# EAGLE design practice 1 (EAGLE 9.6.2)
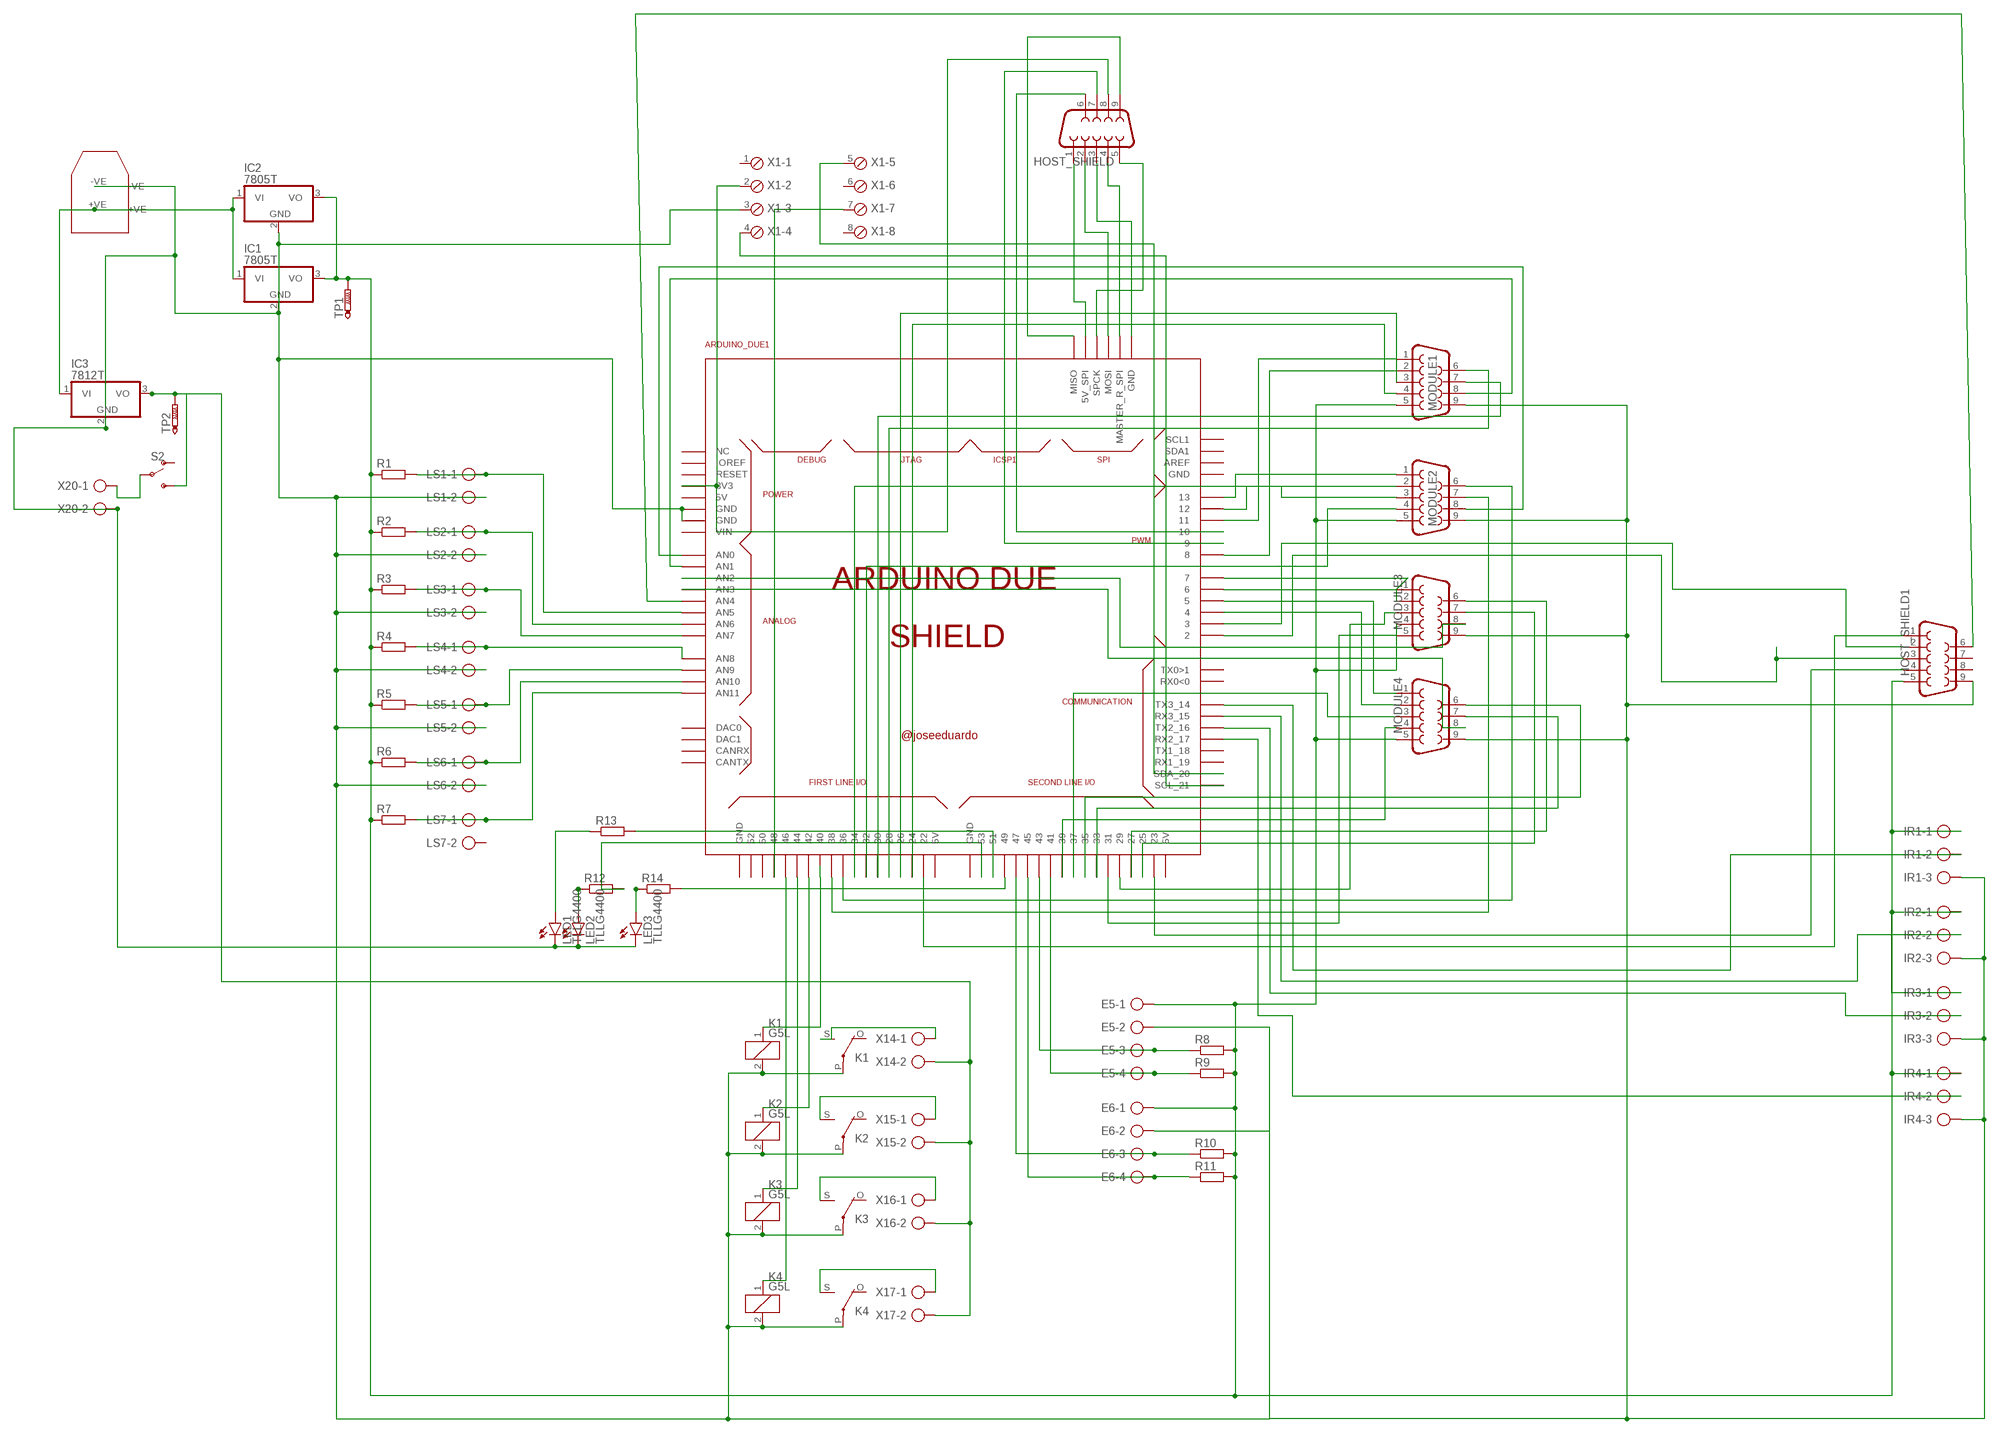
[diagram p0: schematic, sheet 1]

## Parts
ARDUINO_DUE1  ARDUINO_DUE_SHIELD  [ARDUINO_DUE_SHIELD]
E5  AK500/4-H  [AK500/4-H]
E6  AK500/4-H  [AK500/4-H]
HOST_SHIELD  DB9  [DB9_MODULE]
HOST_SHIELD1  DB9  [DB9_MODULE]
IC1  7805T  [TO220H]
IC2  7805T  [TO220H]
IC3  7812T  [TO220H]
IR1  AK500/3-H  [AK500/3-H]
IR2  AK500/3-H  [AK500/3-H]
IR3  AK500/3-H  [AK500/3-H]
IR4  AK500/3-H  [AK500/3-H]
K1  G5L  [G5LE]
K2  G5L  [G5LE]
K3  G5L  [G5LE]
K4  G5L  [G5LE]
LED1  TLLG4400  [LED3MM]
LED2  TLLG4400  [LED3MM]
LED3  TLLG4400  [LED3MM]
LS1  AK500/2-H  [AK500/2-H]
LS2  AK500/2-H  [AK500/2-H]
LS3  AK500/2-H  [AK500/2-H]
LS4  AK500/2-H  [AK500/2-H]
LS5  AK500/2-H  [AK500/2-H]
LS6  AK500/2-H  [AK500/2-H]
LS7  AK500/2-H  [AK500/2-H]
MODULE1  DB9  [DB9_MODULE]
MODULE2  DB9  [DB9_MODULE]
MODULE3  DB9  [DB9_MODULE]
MODULE4  DB9  [DB9_MODULE]
R1  R-EU_0309/10  [0309/10]
R2  R-EU_0309/10  [0309/10]
R3  R-EU_0309/10  [0309/10]
R4  R-EU_0309/10  [0309/10]
R5  R-EU_0309/10  [0309/10]
R6  R-EU_0309/10  [0309/10]
R7  R-EU_0309/10  [0309/10]
R8  R-EU_0309/10  [0309/10]
R9  R-EU_0309/10  [0309/10]
R10  R-EU_0309/10  [0309/10]
R11  R-EU_0309/10  [0309/10]
R12  R-EU_0309/10  [0309/10]
R13  R-EU_0309/10  [0309/10]
R14  R-EU_0309/10  [0309/10]
S2  SWITCH-SPDT-PTH-11.6X4.0MM  [SWITCH_SPDT_PTH_11.6X4.0MM]
TP1  PTR1PAD1-13  [P1-13]
TP2  PTR1PAD1-13  [P1-13]
U$1  XT60XT60  [XT60]
X1  MPT8  [8POL254]
X14  AK500/2-H  [AK500/2-H]
X15  AK500/2-H  [AK500/2-H]
X16  AK500/2-H  [AK500/2-H]
X17  AK500/2-H  [AK500/2-H]
X20  AK500/2-H  [AK500/2-H]

## Nets
GND: ARDUINO_DUE1.GND ARDUINO_DUE1.GND_1(GND) E5.2 E6.2 HOST_SHIELD1.9 IC1.2(GND) IC2.2(GND) IC3.2(GND) IR1.3 IR2.3 IR3.3 IR4.3 K1.2 K1.P(2:P) K2.2 K2.P(2:P) K3.2 K3.P(2:P) K4.2 K4.P(2:P) LED1.K(C) LED2.K(C) LED3.K(C) LS1.2 LS2.2 LS3.2 LS4.2 LS5.2 LS6.2 MODULE1.9 MODULE2.9 MODULE3.9 MODULE4.9 U$1.-VE X1.3 X20.2
N$1: ARDUINO_DUE1.35 MODULE4.6
N$2: ARDUINO_DUE1.37 MODULE4.3
N$3: ARDUINO_DUE1.39 MODULE4.4
N$4: ARDUINO_DUE1.A5(AN5) LS1.1 R1.2
N$5: ARDUINO_DUE1.A6(AN6) LS2.1 R2.2
N$6: ARDUINO_DUE1.A7(AN7) LS3.1 R3.2
N$7: ARDUINO_DUE1.A8(AN8) LS4.1 R4.2
N$8: ARDUINO_DUE1.A9(AN9) LS5.1 R5.2
N$9: ARDUINO_DUE1.A10(AN10) LS6.1 R6.2
N$10: ARDUINO_DUE1.A11(AN11) LS7.1 R7.2
N$11: ARDUINO_DUE1.3 HOST_SHIELD1.2
N$12: ARDUINO_DUE1.43 E5.3 R8.1
N$13: ARDUINO_DUE1.A4(AN4) HOST_SHIELD1.6
N$14: ARDUINO_DUE1.40 K1.1
N$15: ARDUINO_DUE1.41 E5.4 R9.1
N$16: ARDUINO_DUE1.47 E6.3 R10.1
N$17: ARDUINO_DUE1.45 E6.4 R11.1
N$18: ARDUINO_DUE1.53 R12.2
N$19: IC1.1(VI) IC2.1(VI) IC3.1(VI) U$1.+VE
N$20: ARDUINO_DUE1.42 K2.1
N$21: ARDUINO_DUE1.44 K3.1
N$22: ARDUINO_DUE1.46 K4.1
N$23: ARDUINO_DUE1.2 HOST_SHIELD1.3
N$24: ARDUINO_DUE1.22 HOST_SHIELD1.1
N$25: ARDUINO_DUE1.23 HOST_SHIELD1.4
N$26: IC3.3(VO) S2.3(S) TP2.TP X14.2 X15.2 X16.2 X17.2
N$27: K1.S(2:S) X14.1
N$28: K2.S(2:S) X15.1
N$29: K3.S(2:S) X16.1
N$30: K4.S(2:S) X17.1
N$31: S2.2(P) X20.1
N$32: ARDUINO_DUE1.14(TX3_14) IR1.2
N$33: ARDUINO_DUE1.15(RX3_15) IR2.2
N$34: ARDUINO_DUE1.16(TX2_16) IR3.2
N$35: ARDUINO_DUE1.17(RX2_17) IR4.2
N$37: ARDUINO_DUE1.3V3 HOST_SHIELD.8 X1.2
N$38: ARDUINO_DUE1.21(SCL_21) X1.4
N$39: ARDUINO_DUE1.20(SDA_20) X1.5
N$40: ARDUINO_DUE1.48 X1.7
N$41: ARDUINO_DUE1.5V_2(5V_SPI) HOST_SHIELD.1
N$42: ARDUINO_DUE1.MOSI HOST_SHIELD.2
N$43: ARDUINO_DUE1.GND_5(GND) HOST_SHIELD.3
N$44: ARDUINO_DUE1.11 MODULE1.1
N$45: ARDUINO_DUE1.8 MODULE1.2
N$46: ARDUINO_DUE1.26 MODULE1.3
N$47: ARDUINO_DUE1.24 MODULE1.4
N$48: ARDUINO_DUE1.28 MODULE1.6
N$49: ARDUINO_DUE1.30 MODULE1.7
N$50: ARDUINO_DUE1.13 MODULE2.1
N$51: ARDUINO_DUE1.12 MODULE2.2
N$52: ARDUINO_DUE1.34 MODULE2.3
N$53: ARDUINO_DUE1.36 MODULE2.6
N$54: ARDUINO_DUE1.32 MODULE2.4
N$55: ARDUINO_DUE1.38 MODULE2.7
N$56: ARDUINO_DUE1.A1(AN1) MODULE1.8
N$57: ARDUINO_DUE1.A0(AN0) MODULE2.8
N$58: ARDUINO_DUE1.A2(AN2) MODULE3.8
N$59: ARDUINO_DUE1.A3(AN3) MODULE4.8
N$60: ARDUINO_DUE1.7 MODULE3.1
N$61: ARDUINO_DUE1.6 MODULE3.2
N$62: ARDUINO_DUE1.5 MODULE4.1
N$63: ARDUINO_DUE1.4 MODULE4.2
N$64: ARDUINO_DUE1.29 MODULE3.3
N$65: ARDUINO_DUE1.31 E5.1 E6.1 HOST_SHIELD1.5 IC1.3(VO) IC2.3(VO) IR1.1 IR2.1 IR3.1 IR4.1 MODULE1.5 MODULE2.5 MODULE3.4 MODULE3.5 MODULE4.5 R1.1 R2.1 R3.1 R4.1 R5.1 R6.1 R7.1 R8.2 R9.2 R10.2 R11.2 TP1.TP
N$66: ARDUINO_DUE1.25 MODULE3.7
N$67: ARDUINO_DUE1.27 MODULE3.6
N$68: ARDUINO_DUE1.33 MODULE4.7
N$69: ARDUINO_DUE1.MISO HOST_SHIELD.9
N$70: ARDUINO_DUE1.MASTER_RESET_SPI(MASTER_R_SPI) HOST_SHIELD.4
N$71: ARDUINO_DUE1.SPCK HOST_SHIELD.5
N$72: ARDUINO_DUE1.49 R14.2
N$73: ARDUINO_DUE1.51 R13.2
N$74: LED2.A R12.1
N$75: ARDUINO_DUE1.9 HOST_SHIELD.7
N$76: ARDUINO_DUE1.10 HOST_SHIELD.6
N$77: LED1.A R13.1
N$78: LED3.A R14.1
Unconnected: ARDUINO_DUE1.0(RX0<0) ARDUINO_DUE1.1(TX0>1) ARDUINO_DUE1.5V0(5V) ARDUINO_DUE1.5V0_1(5V) ARDUINO_DUE1.5V0_2(5V) ARDUINO_DUE1.18(TX1_18) ARDUINO_DUE1.19(RX1_19) ARDUINO_DUE1.50 ARDUINO_DUE1.52 ARDUINO_DUE1.AREF ARDUINO_DUE1.CANRX ARDUINO_DUE1.CANTX ARDUINO_DUE1.DAC0 ARDUINO_DUE1.DAC1 ARDUINO_DUE1.GND_2(GND) ARDUINO_DUE1.GND_3(GND) ARDUINO_DUE1.GND_4(GND) ARDUINO_DUE1.IOREF ARDUINO_DUE1.NC_2(NC) ARDUINO_DUE1.RESET ARDUINO_DUE1.SCL1 ARDUINO_DUE1.SDA1 ARDUINO_DUE1.VIN HOST_SHIELD1.7 HOST_SHIELD1.8 K1.O(2:O) K2.O(2:O) K3.O(2:O) K4.O(2:O) LS7.2 S2.1(O) X1.1 X1.6 X1.8

## Library data of the parts
ARDUINO_DUE1 = arduino_due_shield (1):ARDUINO_DUE_SHIELD
E5 E6 = con-ptr500:AK500/4-H: CONNECTOR Aug. 2004 / PTR Meßtechnik: Die Bezeichnung der Serie AK505 wurde geändert. Es handelt sich hierbei um AK500 in horizontaler Ausführung.; OC_FARNELL: unknown; OC_NEWARK: unknown
HOST_SHIELD HOST_SHIELD1 MODULE1-MODULE4 = db9_main:DB9
IC1-IC3 = linear:78*: Positive VOLTAGE REGULATOR Source: http://cache.national.com/ds/LM/LM78L05.pdf http://www.fairchildsemi.com/ds/LM/LM7805.pdf
IR1-IR4 = con-ptr500:AK500/3-H: CONNECTOR Aug. 2004 / PTR Meßtechnik: Die Bezeichnung der Serie AK505 wurde geändert. Es handelt sich hierbei um AK500 in horizontaler Ausführung.; OC_FARNELL: unknown; OC_NEWARK: unknown
K1-K4 = relay:G5L: RELAY 1 x switch, 10 A/120 V AC, 8 A/30 V ADC, Omron; OC_FARNELL: unknown; OC_NEWARK: unknown
LED1-LED3 = led:TLLG4400: Low Current (2mA) LED 3 mm Tinted Diffused Package color GREEN Source: Data sheet <http://www.farnell.com/datasheets/391098.pdf>; MF: VISHAY SEMICONDUCTOR; OC_FARNELL: 1612435
LS1-LS7 X14-X17 X20 = con-ptr500:AK500/2-H: CONNECTOR Aug. 2004 / PTR Meßtechnik: Die Bezeichnung der Serie AK505 wurde geändert. Es handelt sich hierbei um AK500 in horizontaler Ausführung.; OC_FARNELL: unknown; OC_NEWARK: unknown
R1-R14 = rcl:R-EU_: RESISTOR, European symbol; SPICEPREFIX: R
S2 = SparkFun-Switches:SWITCH-SPDT: Single Pole, Double Throw (SPDT) Switch Single-pole, double-throw (SPDT) switch. Variant Overview SMD-AYZ0202 Surface Mount DPDT Switch <https://www.sparkfun.com/products/597> (COM-00597) Used on e.g. LilyPad Arduino USB - ATmega32U4 Board <https://www.sparkfun.com/products/12049> PTH-11.6X4.0MM SPDT Mini Power Switch <https://www.sparkfun.com/products/102> (COM-00102) Used on e.g. SparkFun Simon Says - Through-Hole Soldering Kit <https://www.sparkfun.com/products/10547> (KIT-10547) PTH-11.6X4.0MM-KIT KIT version of SPDT Mini Power Switch - Simplifies soldering by removing tStop of switch pins - only one side can be soldered. PTH-11.6X4.0MM-LOCK LOCK version of SPDT Mini Power Switch - Offset pins hold switch in place for easier soldering. SMD-RIGHT-ANGLE Surface Mount Right Angle Switch <https://www.sparkfun.com/products/10860> (COM-10860) Used on e.g. SparkFun ESP8266 Thing <https://www.sparkfun.com/products/13231>; PROD_ID: SWCH-08261; SF_SKU: COM-00102
TP1 TP2 = testpad:PTR1: TEST PIN
U$1 = xt60:XT60: XT60 connector
X1 = con-phoenix-254:MPT8: PHOENIX CONNECTOR; OC_FARNELL: unknown; OC_NEWARK: unknown

## Board
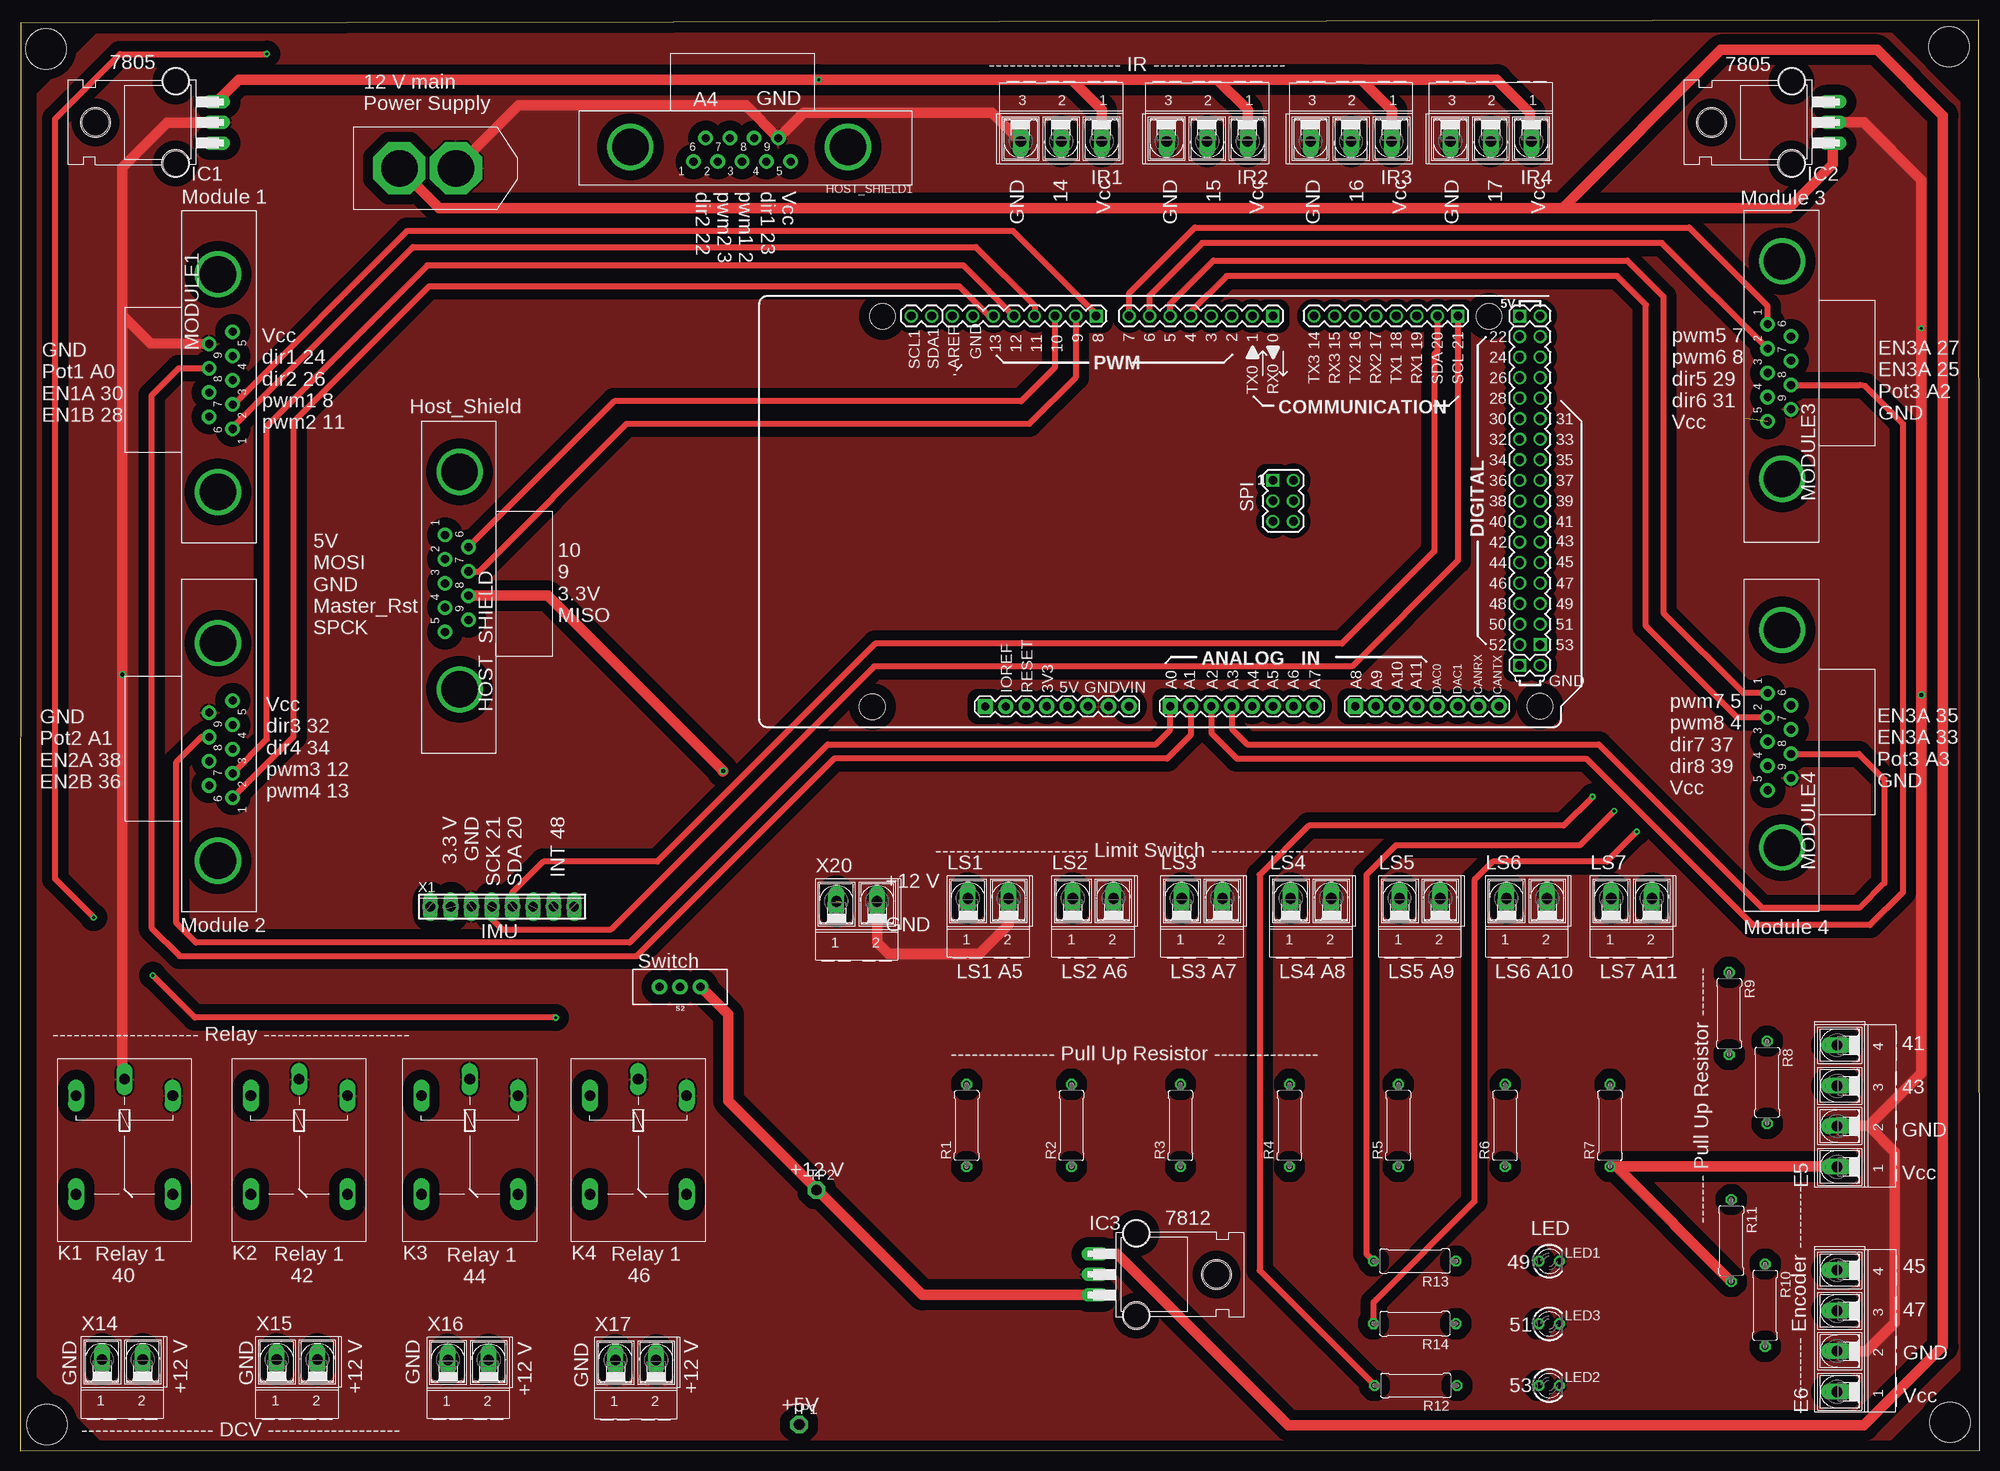
[diagram p1: board, top side]
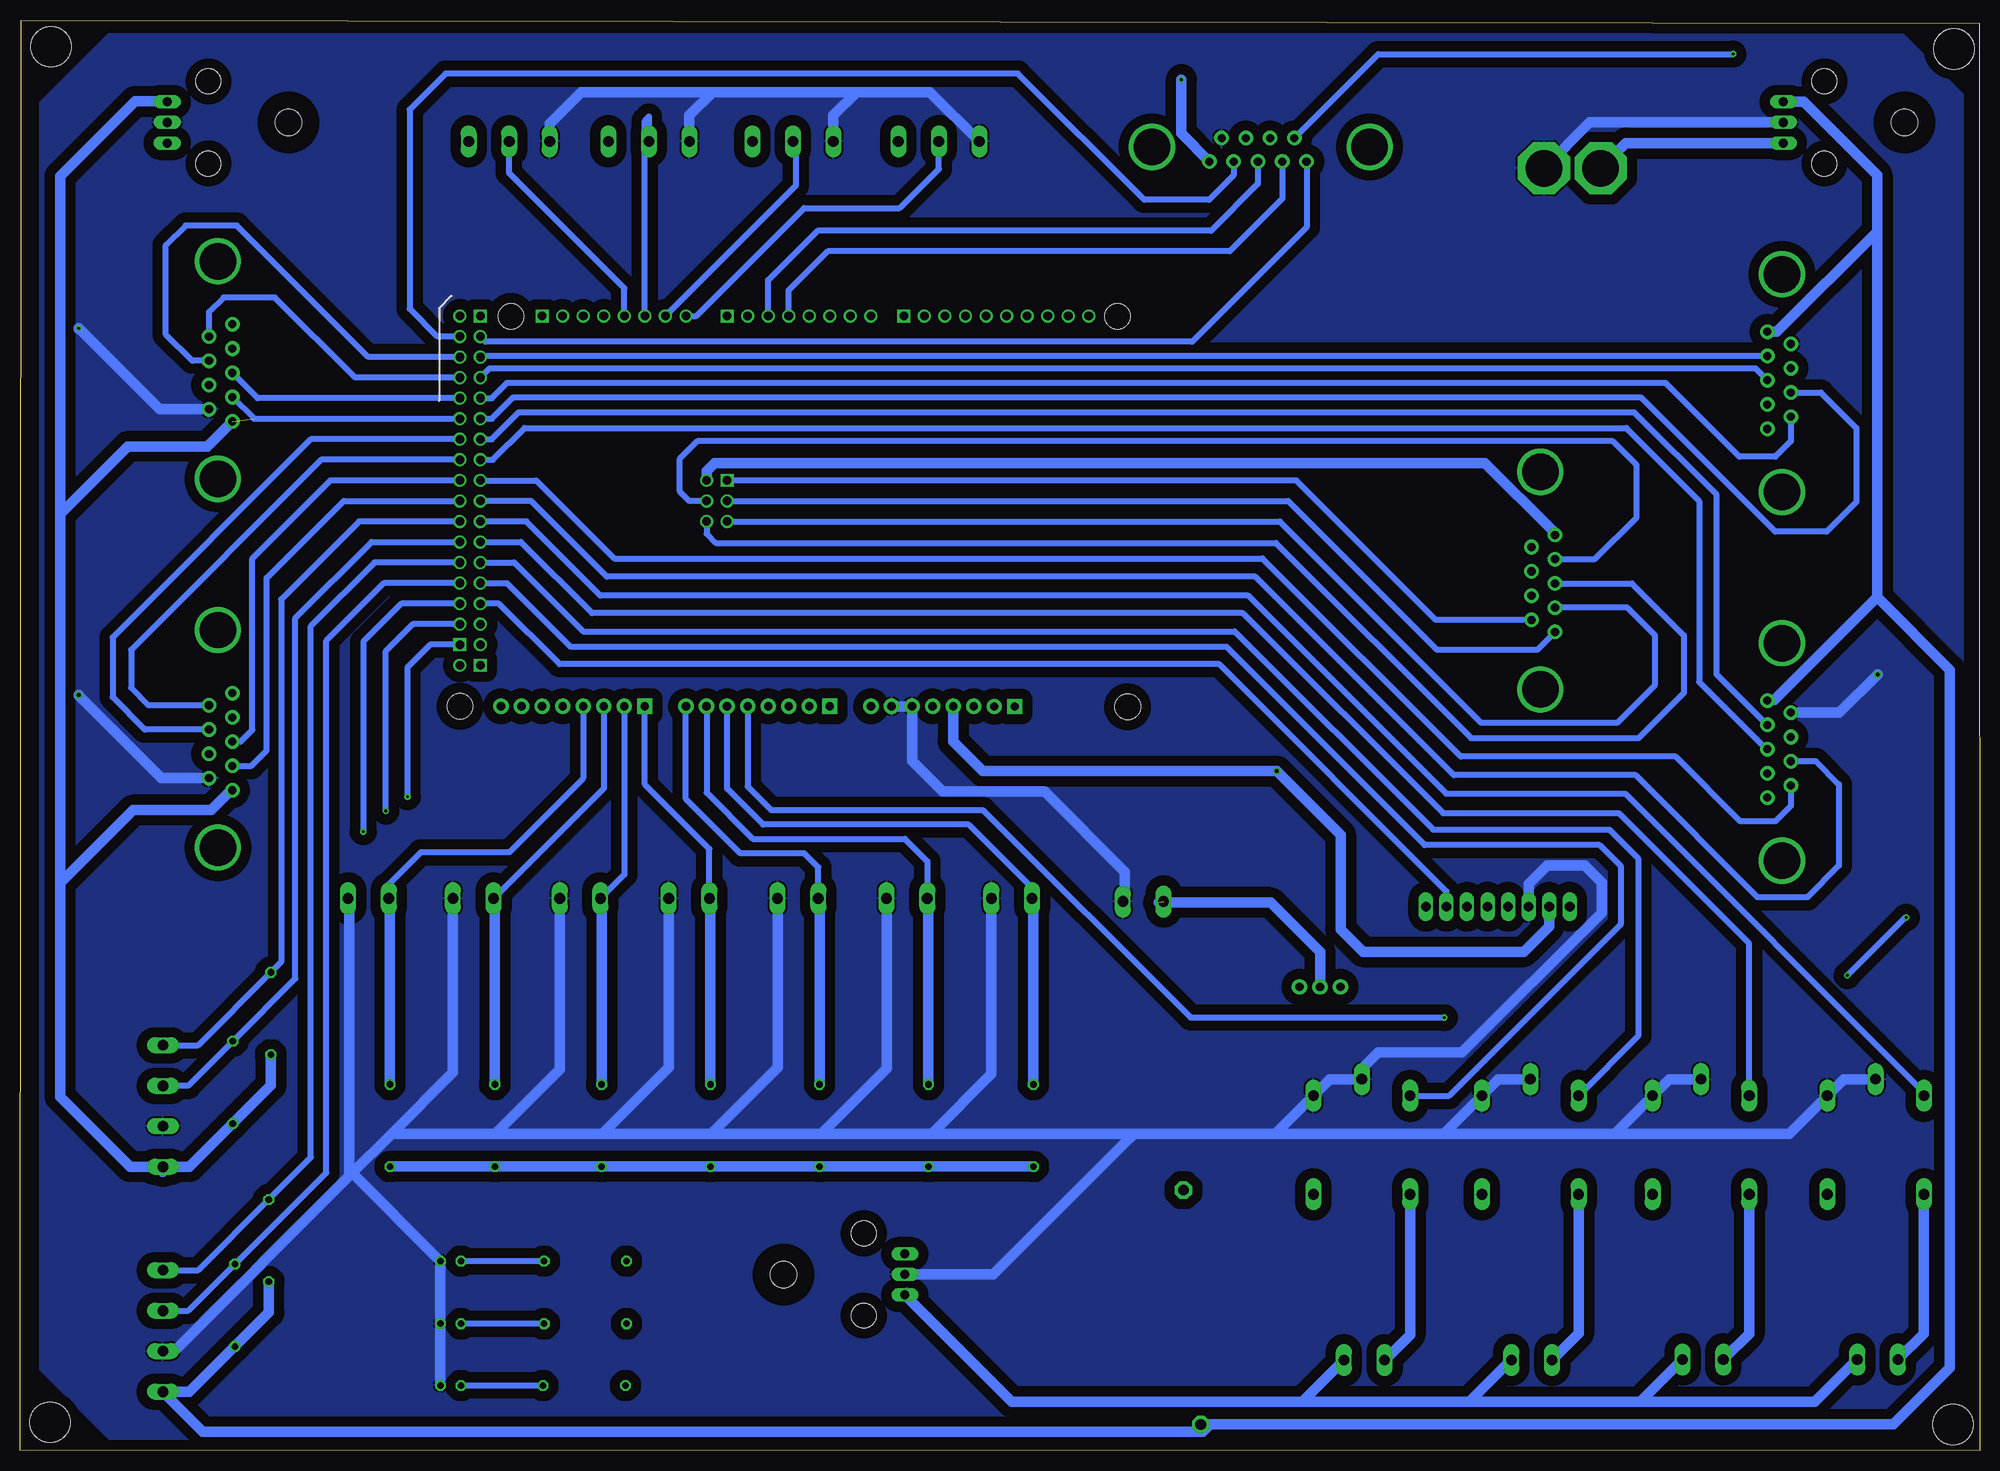
[diagram p2: board, bottom side, seen from below]

Size 242.17 x 176.85 mm. Coordinates in mm from the lower left corner, seen from the top.
Outline: 0,0 242.17,0.05 242.01,176.85 0.05,176.49 0,0
Copper layers (1*16): Top 0.035mm / dielectric 1.5mm / Bottom 0.035mm
Design rules "default": minimum track width 6mil, minimum drill 0.35mm, track to track 6mil, track to pad 6mil, pad to pad 6mil, via to via 6mil, smd to smd 6mil, copper to edge 40mil, drill to drill 6mil, minimum pad ring 10mil, minimum via ring 8mil, stop-mask expansion 4mil, vias tented up to drill 0mil, thermal gap 10mil
Holes 5 mm at 3.17,173.3 3.3,3.25 238.51,3.51 238.38,173.56

### Footprints (pad centres in the part's own frame; a part is rotated, then mirrored left to right if it is on the bottom)
ARDUINO_DUE_SHIELD = drill 1.067 square: 0 63.373,51.816; 5V0_1 93.853,51.816; 8 41.529,51.816; 21 86.233,51.816; 53 96.393,11.176; GND_2 93.853,8.636; MISO 63.373,31.496 | drill 1.067: 1 60.833,51.816; 2 58.293,51.816; 3 55.753,51.816; 4 53.213,51.816; 5 50.673,51.816; 5V0_2 96.393,51.816; 5V_2 65.913,31.496; 6 48.133,51.816; 7 45.593,51.816; 9 38.989,51.816; 10 36.449,51.816; 11 33.909,51.816; 12 31.369,51.816; 13 28.829,51.816; 14 68.453,51.816; 15 70.993,51.816; 16 73.533,51.816; 17 76.073,51.816; 18 78.613,51.816; 19 81.153,51.816; 20 83.693,51.816; 22 93.853,49.276; 23 96.393,49.276; 24 93.853,46.736; 25 96.393,46.736; 26 93.853,44.196; 27 96.393,44.196; 28 93.853,41.656; 29 96.393,41.656; 30 93.853,39.116; 31 96.393,39.116; 32 93.853,36.576; 33 96.393,36.576; 34 93.853,34.036; 35 96.393,34.036; 36 93.853,31.496; 37 96.393,31.496; 38 93.853,28.956; 39 96.393,28.956; 40 93.853,26.416; 41 96.393,26.416; 42 93.853,23.876; 43 96.393,23.876; 44 93.853,21.336; 45 96.393,21.336; 46 93.853,18.796; 47 96.393,18.796; 48 93.853,16.256; 49 96.393,16.256; 50 93.853,13.716; 51 96.393,13.716; 52 93.853,11.176; AREF 23.749,51.816; GND_3 96.393,8.636; GND_4 26.289,51.816; GND_5 65.913,26.416; MASTER_RESET_SPI 63.373,26.416; MOSI 65.913,28.956; SCL1 18.669,51.816; SDA1 21.209,51.816; SPCK 63.373,28.956 | drill 1.016 pad 1.88: 3V3 35.433,3.556; 5V0 37.973,3.556; A1 53.213,3.556; A2 55.753,3.556; A3 58.293,3.556; A4 60.833,3.556; A5 63.373,3.556; A6 65.913,3.556; A7 68.453,3.556; A9 76.073,3.556; A10 78.613,3.556; A11 81.153,3.556; CANRX 88.773,3.556; CANTX 91.313,3.556; DAC0 83.693,3.556; DAC1 86.233,3.556; GND 40.513,3.556; GND_1 43.053,3.556; IOREF 30.346,3.543; RESET 32.893,3.555; VIN 45.593,3.556 | drill 1.016 pad 1.88 square: A0 50.673,3.556; A8 73.533,3.556; NC_2 27.806,3.543 | hole 3.2: 96.393,3.556; 15.138,51.765; 90.068,51.765; 13.868,3.505
AK500/4-H = drill 1.321 long: 1 -7.518,0; 2 -2.489,0; 3 2.489,0; 4 7.518,0
DB9_MODULE = drill 1 pad 1.8: 1 6.46,12.91; 2 3.46,12.91; 3 0.46,12.91; 4 -2.54,12.91; 5 -5.54,12.91; 6 4.96,10.01; 7 1.96,10.01; 8 -1.04,10.01; 9 -4.04,10.01 | drill 4.5 pad 5.7: 10 -12.64,11.11; 11 14.26,11.11
TO220H = drill 1.118 long: 1 -2.54,-10.16; 2 0,-10.16; 3 2.54,-10.16 | hole 3.302: 0,4.826 | hole 3.1: -5.08,-5.08; 5.08,-5.08
AK500/3-H = drill 1.321 long: 1 -5.004,0; 2 0,0; 3 5.004,0
G5LE = drill 1.321 long: 1 -7.493,-5.969; 2 -7.493,5.969; O 4.699,5.969; P -9.525,0; S 4.699,-5.969
LED3MM = drill 0.813 octagon: A -1.27,0; K 1.27,0
AK500/2-H = drill 1.321 long: 1 -2.515,0; 2 2.515,0
0309/10 = drill 0.813 octagon: 1 -5.08,0; 2 5.08,0
SWITCH_SPDT_PTH_11.6X4.0MM = drill 1.016 pad 1.88: 1 0,2.54; 2 0,0; 3 0,-2.54
P1-13 = drill 1.321 pad 2.159 octagon: TP 0,0
XT60 = drill 4.5 pad 6.452 octagon: +VE 0,-7; -VE 0,0
8POL254 = drill 1.2 long: 1 -8.89,0; 2 -6.35,0; 3 -3.81,0; 4 -1.27,0; 5 1.27,0; 6 3.81,0; 7 6.35,0; 8 8.89,0

### Placement (x,y rotation side)
ARDUINO_DUE1  91.44,88.47 0 top
E5  224.54,42.62 90 top
E6  224.54,14.81 90 top
HOST_SHIELD  65.41,106.76 90 top
HOST_SHIELD1  89.66,172.29 180 top
IC1  14.12,164.21 90 top
IC2  213.84,164.21 90 top
IC3  143,21.79 270 top
IR1  128.65,161.87 180 top
IR2  146.69,161.87 180 top
IR3  164.47,161.87 180 top
IR4  181.74,161.87 180 top
K1  12.88,36.4 270 top
K2  34.47,36.4 270 top
K3  55.55,36.4 270 top
K4  76.38,36.4 270 top
LED1  188.98,23.44 0 top
LED2  188.98,8.08 0 top
LED3  188.98,15.7 0 top
LS1  119.63,68.28 0 top
LS2  132.59,68.28 0 top
LS3  146.05,68.28 0 top
LS4  159.51,68.28 0 top
LS5  172.97,68.28 0 top
LS6  186.18,68.28 0 top
LS7  199.14,68.28 0 top
MODULE1  13.34,132.79 270 top
MODULE2  13.34,87.2 270 top
MODULE3  228.85,132.79 90 top
MODULE4  228.85,87.2 90 top
R1  116.97,40.21 90 top
R2  129.92,40.21 90 top
R3  143.38,40.21 90 top
R4  156.84,40.21 90 top
R5  170.31,40.21 90 top
R6  183.52,40.21 90 top
R7  196.47,40.21 90 top
R8  215.9,45.54 270 top
R9  211.2,54.05 270 top
R10  215.65,17.98 270 top
R11  211.46,25.98 270 top
R12  172.47,8.08 180 top
R13  172.34,23.44 180 top
R14  172.34,15.7 180 top
S2  81.53,57.35 90 top
TP1  96.27,3.25 0 top
TP2  98.43,32.21 0 top
U$1  53.85,158.55 270 top
X1  59.56,67.26 0 top
X14  12.62,11.28 0 top
X15  34.21,11.28 0 top
X16  55.37,11.23 0 top
X17  76.07,11.2 0 top
X20  103.38,67.89 0 top

### Tracks (layer width: path | path; a pad name or v marks a point on that pad's centre or on a via)
GND  (via drill 0.35, 0.5)
  Top 1.27: IC1.2 24.26,164.19 18.19,164.19 12.62,158.62 12.62,140.41 | 13,46.05 K1.P 12.62,46.18 v12.62,95.96 12.62,140.41 | 12.62,140.41 16.08,136.95 MODULE1.9 | E5.2 228.42,40.13 | 228.42,40.13 231.65,36.91 231.65,15.82 228.14,12.32 E6.2 | IC2.2 227.81,164.21 234.95,157.07 v234.95,138.76 v234.95,93.42 234.95,46.66 228.42,40.13 | LS1.2 122.15,65.08 118.49,61.42 107.34,61.42 105.89,62.87 X20.2 | U$1.-VE 61.62,166.32 89.66,166.32 HOST_SHIELD1.9 96.85,165.43 120.09,165.43 IR1.3
  Bottom 1.27: LS1.2 122.15,46.58 129.54,39.19 | 129.54,39.19 143.18,39.19 | LS2.2 135.1,47.27 143.18,39.19 | LS3.2 148.56,47.4 156.46,39.5 156.46,39.19 | LS4.2 162.03,47.4 170.18,39.24 170.18,39.19 | LS5.2 175.49,47.14 183.44,39.19 | LS6.2 188.7,46.76 196.27,39.19 | 45.14,39.19 23.55,39.19 K1.2 16.82,45.92 K1.P | 87.02,39.22 K4.2 80.31,45.92 K4.P 76.38,47.19 74.35,49.23 64.01,49.23 46.74,66.5 46.74,70.26 48.82,72.34 53.47,72.34 55.75,70.05 X1.3 | 87.02,39.22 87.05,39.19 104.52,39.19 | 66.22,39.19 45.14,39.19 | 45.14,39.19 K2.2 38.41,45.92 K2.P | 66.22,39.19 K3.2 59.49,45.92 K3.P | IR1.3 129.74,167.97 138.81,167.97 | 138.81,167.97 156.59,167.97 | 156.59,167.97 172.85,167.97 176.73,164.08 IR4.3 | IR3.3 159.46,165.1 156.59,167.97 | IR2.3 141.68,165.1 138.81,167.97 | 104.52,39.19 129.54,39.19 | 105.92,37.8 | 105.92,37.8 121.92,21.79 IC3.2 | 105.92,37.8 104.52,39.19 | 66.22,39.19 87,39.19 87.02,39.22 | 143.18,39.19 156.46,39.19 | 156.46,39.19 170.18,39.19 | 170.18,39.19 183.44,39.19 | 183.44,39.19 196.27,39.19 | 196.27,39.19 201.38,34.07 | 201.38,34.07 223.14,12.32 E6.2 | v234.95,93.42 234.95,93.35 224.76,83.16 MODULE4.9 | IC1.2 48.18,164.21 U$1.-VE | 234.95,138.68 v234.95,138.76 224.94,128.75 MODULE3.9 | LED2.K LED3.K LED1.K 201.52,34.72 | 201.52,68.15 201.52,34.72 | 201.52,34.72 201.52,34.21 201.38,34.07 | MODULE2.9 17.35,91.24 v12.62,95.96 | ARDUINO_DUE1.GND_1 ARDUINO_DUE1.GND 131.95,85.29 128.14,81.48 115.57,81.48 105.66,71.58 105.66,68.12 X20.2
  pour Top (isolate 1.27): 2.03,166.57 2.03,9.22 9.91,1.35 231.14,1.35 239.78,9.98 239.78,166.7 231.27,175.21 9.53,175.21 2.16,167.84 2.03,167.72
  pour Bottom (isolate 1.27): 2.03,166.57 2.03,9.22 9.78,1.47 9.91,1.35 11.3,1.35 231.14,1.35 239.65,9.86 239.78,9.98 239.78,166.7 231.39,175.08 231.27,175.21 227.84,175.21 9.53,175.21 2.03,167.72
N$1
  Bottom 0.762: ARDUINO_DUE1.35 204.98,122.5 228.47,99.01 228.47,94.31 226.32,92.16 MODULE4.6
N$2
  Bottom 0.762: ARDUINO_DUE1.37 203.84,119.96 213.49,110.31 213.49,89.1 214.93,87.66 MODULE4.3
N$3
  Bottom 0.762: ARDUINO_DUE1.39 202.18,117.42 211.71,107.9 211.71,86.56 213.61,84.66 MODULE4.4 215.17,84.66
N$4
  Bottom 0.762: LS1.1 117.12,69.57 124.97,77.42 150.37,77.42 154.81,81.86 ARDUINO_DUE1.A5
  Bottom 1.27: LS1.1 116.99,68.15 116.99,45.31 R1.2
N$5
  Bottom 0.762: ARDUINO_DUE1.A6 157.35,81.36 151.64,75.64 132.84,75.64 130.07,72.87 LS2.1
  Bottom 1.27: LS2.1 129.95,68.15 129.95,45.31 R2.2
N$6
  Bottom 0.762: 143.76,68.28 LS3.1 143.53,72.11 145.29,73.86 153.16,73.86 159.89,80.59 ARDUINO_DUE1.A7
  Bottom 1.27: R3.2 143.38,68.12 LS3.1
N$7
  Bottom 0.762: LS4.1 157,74.4 164.97,82.37 ARDUINO_DUE1.A8
  Bottom 1.27: LS4.1 156.87,68.15 156.87,45.31 R4.2
N$8
  Bottom 0.762: ARDUINO_DUE1.A9 167.51,71.22 LS5.1 170.46,65.51 170.43,65.48
  Bottom 1.27: LS5.1 170.33,68.15 170.33,45.31 R5.2
N$9
  Bottom 0.762: ARDUINO_DUE1.A10 170.05,81.89 LS6.1
  Bottom 1.27: LS6.1 183.54,68.15 183.54,45.31 R6.2
N$10
  Bottom 0.762: ARDUINO_DUE1.A11 172.59,83.13 181.74,73.99 192.66,73.99 196.62,70.03 LS7.1
  Bottom 1.27: LS7.1 196.49,68.15 196.49,45.31 R7.2
N$11
  Bottom 0.762: ARDUINO_DUE1.3 147.19,143.46 142.37,148.29 92.71,148.29 86.2,154.79 HOST_SHIELD1.2
N$12
  Bottom 0.762: ARDUINO_DUE1.43 198.75,112.34 208.15,102.95 208.15,58.37 R8.1 221.41,45.11 E5.3
N$13  (via drill 0.35)
  Top 0.762: v66.17,53.54 21.59,53.54 v16.38,58.75 | v9.08,65.93 4.32,70.69 4.32,164.67 12.32,172.67 v30.48,172.67
  Bottom 0.762: ARDUINO_DUE1.A4 152.27,82.12 149.35,79.2 123.19,79.2 97.54,53.54 v66.17,53.54 | v16.38,58.75 9.14,65.99 v9.08,65.93 | HOST_SHIELD1.6 74.31,172.67 v30.48,172.67
N$14
  Bottom 0.762: ARDUINO_DUE1.40 179.63,114.88 170.46,105.72 90.42,105.72 65.94,81.23 43.81,81.23 6.91,44.32 K1.1
N$15
  Bottom 0.762: ARDUINO_DUE1.41 200.28,114.88 209.93,105.23 209.93,60.4 R9.1 220.19,50.14 E5.4
N$16
  Bottom 0.762: 224.46,17.3 E6.3 221.41,17.3 R10.1 204.34,34.37 204.34,100.15 197.23,107.26 ARDUINO_DUE1.47
N$17
  Bottom 0.762: ARDUINO_DUE1.45 198.37,109.8 206.25,101.93 206.25,36.27 R11.1 220.19,22.33 E6.4 224.05,22.33
N$18  (via drill 0.35)
  Top 0.762: v194.31,80.85 190.75,77.29 159.26,77.29 153.16,71.2 153.16,22.3 R12.2
  Bottom 0.762: ARDUINO_DUE1.53 191.52,99.64 194.31,96.85 v194.31,80.85
N$19
  Top 1.27: IC2.1 224,159.06 218.57,153.62 190.63,153.62 | U$1.+VE 51.78,153.62 190.63,153.62 | IC3.1 135.51,24.33 156.72,3.12 227.84,3.12 237.62,12.9 237.62,165.05 229.49,173.18 210.19,173.18 190.63,153.62
  Bottom 1.27: U$1.+VE 43.72,161.67 IC1.1
N$20
  Bottom 0.762: ARDUINO_DUE1.42 180.29,112.34 171.5,103.56 91.06,103.56 66.32,78.82 44.63,78.82 28.5,62.69 K2.1 28.5,45.34
N$21
  Bottom 0.762: K3.1 42.22,51.26 42.22,73.23 45.77,76.78 67.56,76.78 92.07,101.3 172.62,101.3 181.13,109.8 ARDUINO_DUE1.44
N$22
  Bottom 0.762: ARDUINO_DUE1.46 182.02,107.26 174.12,99.37 93.09,99.37 68.6,74.88 46.99,74.88 44.32,72.21 44.32,65.15 65.58,43.89 K4.1
N$23
  Bottom 0.762: ARDUINO_DUE1.2 149.73,144.73 143.64,150.83 95,150.83 89.2,156.62 HOST_SHIELD1.3
N$24
  Bottom 0.762: ARDUINO_DUE1.22 184.66,137.11 97.34,137.11 83.2,151.24 HOST_SHIELD1.1
N$25
  Bottom 0.762: ARDUINO_DUE1.23 190.63,137.74 194.06,141.17 194.06,165.81 189.61,170.26 118.87,170.26 103.25,154.64 95.25,154.64 92.2,157.68 HOST_SHIELD1.4
N$26
  Top 0.152: TP2.TP 98.49,32.27
  Top 1.27: IC3.3 111.51,19.25 98.49,32.27 87.5,43.26 87.5,53.92 S2.3
  Bottom 1.27: 132.59,19.51 IC3.3 119.63,6.05 83.74,6.05 | X14.2 20.37,6.05 41.96,6.05 | 63.07,6.05 83.74,6.05 | 63.07,6.05 41.96,6.05 | X15.2 41.96,6.05 | X16.2 63.07,6.05 | X17.2 83.74,6.05
N$27
  Bottom 1.27: K1.S 6.91,14.48 X14.1
N$28
  Bottom 1.27: K2.S 28.5,14.48 X15.1
N$29
  Bottom 1.27: K3.S 49.58,14.5 X16.1
N$30
  Bottom 1.27: X17.1 70.41,14.35 K4.S
N$31  (1 unrouted)
  Bottom 1.27: S2.2 81.53,61.67 87.63,67.77 101.47,67.77
N$32
  Bottom 0.762: ARDUINO_DUE1.14 158.62,140.28 145.29,153.62 133.48,153.62 128.65,158.45 IR1.2
N$33
  Bottom 0.762: ARDUINO_DUE1.15 146.3,156.41 146.3,161.49 IR2.2
N$34
  Bottom 0.762: ARDUINO_DUE1.16 164.97,164.41 164.47,164.92 IR3.2
N$35
  Bottom 0.762: IR4.2 181.77,161.84 181.77,157.97 167.51,143.71 ARDUINO_DUE1.17
N$37  (via drill 0.5)
  Top 1.27: 86.79,83.95 v86.87,84.02 65.18,105.72 HOST_SHIELD.8
  Bottom 1.27: ARDUINO_DUE1.3V3 126.87,87.71 123.19,84.02 v86.87,84.02 78.99,76.15 78.99,64.47 76.2,61.67 56.39,61.67 53.21,64.85 X1.2
N$38
  Top 0.762: X1.4 58.29,65.74 59.56,64.47 73.03,64.47 105.54,96.98 164.59,96.98 177.67,110.06 177.67,129.87 ARDUINO_DUE1.21
N$39
  Top 0.762: ARDUINO_DUE1.20 175.13,135.97 174.75,135.59 174.75,111.2 163.32,99.77 105.66,99.77 78.74,72.85 64.64,72.85 60.83,69.04 X1.5
N$40
  Bottom 0.762: X1.7 65.91,69.16 93.98,97.23 175.51,97.23 183.01,104.72 ARDUINO_DUE1.48
N$41
  Bottom 1.27: ARDUINO_DUE1.5V_2 157.35,121.11 156.34,122.12 61.16,122.12 52.83,113.79 HOST_SHIELD.1
N$42
  Bottom 0.762: ARDUINO_DUE1.MOSI 159.51,117.42 160.66,118.57 160.66,122.63 158.5,124.79 45.34,124.79 42.42,121.87 42.42,115.39 47.59,110.22 HOST_SHIELD.2
N$43
  Bottom 0.762: ARDUINO_DUE1.GND_5 157.35,113.36 156.21,112.22 87,112.22 62.87,88.09 42.16,88.09 36.58,93.68 36.58,100.79 43.01,107.22 HOST_SHIELD.3
N$44
  Top 0.762: ARDUINO_DUE1.11 125.35,141.55 118.11,148.79 48.51,148.79 26.04,126.32 26.16,126.33 MODULE1.1
N$45
  Top 0.762: ARDUINO_DUE1.8 132.97,140.54 122.68,150.83 47.85,150.83 26.25,129.23 MODULE1.2
N$46
  Bottom 0.762: ARDUINO_DUE1.26 184.15,133.81 27.72,133.81 MODULE1.3
N$47
  Bottom 0.762: ARDUINO_DUE1.24 185.29,135.23 185.12,135.41 26.32,135.41 MODULE1.4
N$48
  Bottom 0.762: ARDUINO_DUE1.28 183.9,130.12 181.99,132.03 38.86,132.03 29.72,122.89 25.27,122.89 23.34,124.81 MODULE1.6
N$49
  Bottom 0.762: ARDUINO_DUE1.30 183.9,127.58 181.23,130.25 41.91,130.25 25.27,113.61 18.92,113.61 15.24,117.3 15.24,126.44 19.63,130.83 MODULE1.7
N$50
  Top 0.762: ARDUINO_DUE1.13 119.76,140.28 116.08,143.97 50.55,143.97 33.78,127.2 33.78,88.28 MODULE2.1
N$51
  Top 0.762: ARDUINO_DUE1.12 116.59,146.51 50.29,146.51 30.48,126.7 30.48,87.96 26.23,83.72 MODULE2.2
N$52
  Bottom 0.762: ARDUINO_DUE1.34 183.77,122.5 179.83,126.44 43.69,126.44 34.67,117.42 34.67,95.05 26.38,86.75 26.38,86.74 MODULE2.3
N$53
  Bottom 0.762: ARDUINO_DUE1.36 178.41,119.96 168.76,110.31 88.65,110.31 64.13,85.8 37.59,85.8 29.59,77.8 25.27,77.8 23.34,79.73 MODULE2.6
N$54
  Bottom 0.762: ARDUINO_DUE1.32 183.9,125.04 180.59,128.35 42.67,128.35 32.51,118.19 32.51,95.96 26.49,89.94 26.49,89.99 MODULE2.4
N$55
  Bottom 0.762: ARDUINO_DUE1.38 179.05,117.42 169.67,108.05 89.53,108.05 65,83.52 42.55,83.52 27.43,68.4 21.34,68.4 17.4,72.34 17.4,82.37 20.27,85.24 MODULE2.7
N$56
  Top 0.762: ARDUINO_DUE1.A1 144.65,88.47 141.73,85.55 100.58,85.55 76.2,61.16 19.68,61.16 16.26,64.59 16.26,130.51 19.58,133.83 MODULE1.8
N$57
  Top 0.762: ARDUINO_DUE1.A0 142.11,89.1 140.34,87.33 99.82,87.33 75.31,62.81 21.72,62.81 19.3,65.23 19.3,85.17 22.38,88.24 MODULE2.8
N$58
  Top 0.762: ARDUINO_DUE1.A2 147.19,88.72 150.37,85.55 193.55,85.55 214.12,64.97 228.6,64.97 232.66,69.04 232.66,126.95 227.99,131.63 227.36,131.75 MODULE3.8
N$59
  Top 0.762: ARDUINO_DUE1.A3 149.73,89.23 151.64,87.33 195.07,87.33 215.27,67.13 227.33,67.13 230.38,70.18 230.38,83.01 227.23,86.16 MODULE4.8
N$60
  Top 0.762: ARDUINO_DUE1.7 137.03,143.08 145.16,151.21 206.25,151.21 215.94,141.51 MODULE3.1
N$61
  Top 0.762: ARDUINO_DUE1.6 139.57,142.82 146.05,149.3 202.89,149.3 MODULE3.2
N$62
  Top 0.762: ARDUINO_DUE1.5 142.11,141.81 147.45,147.14 198.63,147.14 203.07,142.7 203.07,103.58 213,93.66 MODULE4.1
N$63
  Top 0.762: ARDUINO_DUE1.4 144.65,140.79 149.1,145.24 197.36,145.24 200.91,141.68 200.91,101.93 212.19,90.66 MODULE4.2
N$64
  Bottom 0.762: ARDUINO_DUE1.29 212.82,130.12 MODULE3.3
N$65  (via drill 0.35)  (1 unrouted)
  Top 1.27: IC1.3 27.03,169.49 v98.68,169.49 129.92,169.49 | 129.92,169.49 147.96,169.49 | 165.74,169.49 182.5,169.49 186.56,165.43 186.56,162.05 IR4.1 | IR3.1 169.47,165.1 169.55,165.18 169.55,165.68 165.74,169.49 | IR2.1 151.69,165.76 147.96,169.49 | IR1.1 133.66,165.76 129.92,169.49 | E5.1 224.51,35.13 R7.1 197.23,35.13 R11.2 | 165.74,169.49 147.96,169.49
  Bottom 0.152: TP1.TP 95.12,3.25
  Bottom 0.762: MODULE3.4 213.28,127.58 ARDUINO_DUE1.31
  Bottom 1.27: R1.1 R2.1 R3.1 R4.1 R5.1 R6.1 R7.1 | 224.38,7.44 E6.1 | E6.1 219.61,2.36 96.01,2.36 95.12,3.25 10.67,3.25 3.68,10.24 3.68,96.52 12.57,105.41 12.6,105.41 12.7,105.51 | 224.31,7.29 E6.1 | IC1.3 21.77,166.75 12.7,157.68 12.7,150.73 | 12.7,150.73 12.7,105.51 | E6.1 221.26,7.29 R10.2 211.46,17.09 R11.2 | R9.2 211.2,45.16 R8.2 221.26,35.1 E5.1 | E5.1 224.54,34.49 | E5.1 228.58,35.1 237.24,43.76 237.24,70.18 | IC2.3 224.01,166.83 227.97,166.83 237.24,157.56 237.24,115.77 | 237.24,70.18 237.24,115.77 | MODULE2.5 25.42,92.79 12.7,105.51 | 237.24,70.18 228.22,79.2 218.55,79.2 216.08,81.66 MODULE4.5 | 237.24,115.77 228.85,124.16 219.04,124.16 MODULE3.5 | MODULE1.5 25.1,138.33 12.7,150.73 | HOST_SHIELD1.5 98.68,162.86 v98.68,169.49
N$66
  Bottom 0.762: ARDUINO_DUE1.25 199.14,135.2 215.39,151.46 221.74,151.46 224.16,149.05 224.16,138 220.91,134.75 MODULE3.7
N$67
  Bottom 0.762: ARDUINO_DUE1.27 200.79,132.66 210.69,142.57 217.04,142.57 218.84,140.77 MODULE3.6
N$68
  Bottom 0.762: ARDUINO_DUE1.33 206.25,125.04 230.76,100.53 230.76,93.17 226.75,89.16 MODULE4.7
N$69
  Bottom 0.762: ARDUINO_DUE1.MISO 84.46,119.96 67.21,102.72 HOST_SHIELD.9
N$70
  Bottom 0.762: ARDUINO_DUE1.MASTER_RESET_SPI 86.49,114.88 61.6,89.99 44.83,89.99 40.13,94.69 40.13,100.79 43.56,104.22 HOST_SHIELD.4
N$71
  Bottom 0.762: ARDUINO_DUE1.SPCK 85.47,117.42 67.06,99.01 54.7,99.01 HOST_SHIELD.5
N$72  (via drill 0.35)
  Top 0.762: v199.77,76.53 196.09,72.85 181.99,72.85 179.71,70.56 179.71,30.81 167.58,18.68 167.26,18.36 R14.2
  Bottom 0.762: ARDUINO_DUE1.49 195.07,104.72 199.77,100.03 v199.77,76.53
N$73  (via drill 0.35)
  Top 0.762: R13.2 166.37,24.33 166.37,71.2 170.05,74.88 192.79,74.88 v196.98,79.07
  Bottom 0.762: ARDUINO_DUE1.51 193.68,102.18 196.98,98.88 v196.98,79.07
N$74
  Bottom 0.762: LED2.A R12.1
N$75
  Top 0.762: ARDUINO_DUE1.9 130.43,132.66 124.71,126.95 74.93,126.95 56.7,108.72 HOST_SHIELD.7
N$76
  Top 0.762: ARDUINO_DUE1.10 127.89,133.93 123.7,129.74 73.42,129.74 HOST_SHIELD.6
N$77
  Bottom 0.762: R13.1 LED1.A
N$78
  Bottom 0.762: R14.1 LED3.A

### Text on the board
tPlace: 7805 | ------------------- IR ------------------- | 7805 | A4 | GND | 12 V main / Power Supply | GND / / 14 / / Vcc | GND / / 15 / / Vcc | GND / / 16 / / Vcc | GND / / 17 / / Vcc | Vcc / dir1 23 / pwm1 2 / pwm2 3 / dir2 22 | Module 1 | Module 3 | Host_Shield | EN3A 27 / EN3A 25 / Pot3 A2 / GND | GND / Pot1 A0 / EN1A 30 / EN1B 28 | Vcc / dir1 24 / dir2 26 / pwm1 8 / pwm2 11 | pwm5 7 / pwm6 8 / dir5 29 / dir6 31 / Vcc | 10 / 9 / 3.3V / MISO | 5V / MOSI / GND / Master_Rst / SPCK | GND / Pot2 A1 / EN2A 38 / EN2B 36 | EN3A 35 / EN3A 33 / Pot3 A3 / GND | Vcc / dir3 32 / dir4 34 / pwm3 12 / pwm4 13 | 3.3 V / GND / SCK 21 / SDA 20 / / INT 48 | pwm7 5 / pwm8 4 / dir7 37 / dir8 39 / Vcc | ---------------------- Limit Switch ---------------------- | Module 2 | +12 V / / GND | Module 4 | IMU | Switch | ------- Pull Up Resistor ------- | LS1 A5 | LS2 A6 | LS3 A7 | LS4 A8 | LS5 A9 | LS6 A10 | LS7 A11 | --------------------- Relay --------------------- | --------------- Pull Up Resistor --------------- | +12 V | 41 / / 43 / / GND / / Vcc | 7812 | LED | 49 | Relay 1 / 40 | Relay 1 / 42 | Relay 1 / 44 | Relay 1 / 46 | 51 | GND | GND | GND | GND | +12 V | +12 V | +12 V | +12 V | 53 | 45 / / 47 / / GND / / Vcc | +5V | ----------- Encoder ----------- | ------------------- DCV -------------------